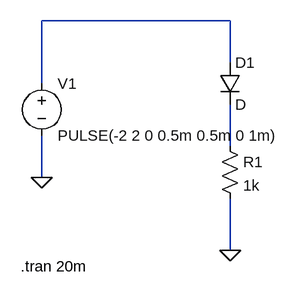
[diagram p0: schematic SimpleDiod.asc]
SimpleDiod.asc, the LTspice schematic file:
Version 4
SHEET 1 880 680
WIRE 400 16 112 16
WIRE 400 80 400 16
WIRE 112 112 112 16
WIRE 400 208 400 144
WIRE 112 256 112 192
WIRE 400 368 400 288
FLAG 112 256 0
FLAG 400 368 0
SYMBOL voltage 112 96 R0
WINDOW 123 0 0 Left 2
WINDOW 39 0 0 Left 2
SYMATTR InstName V1
SYMATTR Value PULSE(-2 2 0 0.5m 0.5m 0 1m)
SYMBOL diode 384 80 R0
SYMATTR InstName D1
SYMBOL res 384 192 R0
SYMATTR InstName R1
SYMATTR Value 1k
TEXT 80 392 Left 2 !.tran 20m

The netlist it stands for:
* SimpleDiod.asc
V1 N001 0 PULSE(-2 2 0 0.5m 0.5m 0 1m)
D1 N001 N002 D
R1 N002 0 1k
.model D D
.lib standard.dio
.tran 20m
.backanno
.end